# Altium schematic sheet Digital_Psu.SchDoc: Digital PSU
size A4; DrawnBy: Michael Watzek; Organization: HTL Hollabrunn; Address1: Abteilung Elektronik; Address2: Anton Ehrenfried-Straße 10; Address3: 2020 Hollabrunn; DocumentNumber: 07; Revision: 02; SheetNumber: 07; SheetTotal: 12; SPICEModelCacheAWIPVUZH: <root> / <DocumentId>AWIPVUZH</DocumentId> / <CacheFrame Number="0"> / <Model Name="cap" Kind="MDL"> / <Text>*Default semiconductor capacitor / .MODEL CAP C()</Text> / </Model> / </CacheFrame> / </root>
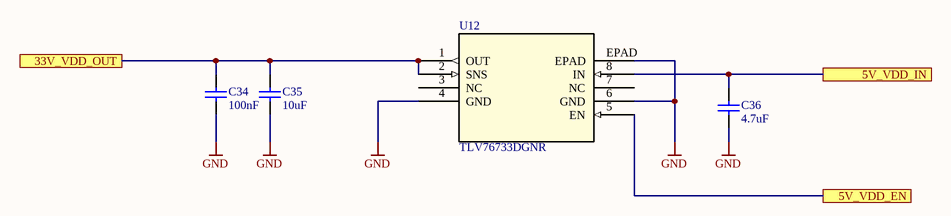
[diagram p0: Digital_Psu.SchDoc]

## Parts
C34  100nF  [C1206-KUE]
C35  10uF  [C1206-KUE]
C36  4.7uF  [C1206-KUE]
U12  TLV76733DGNR  [VSSOP8_DGN_TEX]

## Ports
5V_VDD_EN, 5V_VDD_IN, 33V_VDD_OUT

## Nets
GND: C34.1 C35.1 C36.1 U12.4(GND) U12.6(GND) U12.EPAD
5V_VDD_EN: U12.5(EN) ; port 5V_VDD_EN
5V_VDD_IN: C36.2 U12.8(IN) ; port 5V_VDD_IN
33V_VDD_OUT: C34.2 C35.2 U12.1(OUT) U12.2(SNS) ; port 33V_VDD_OUT

Not connected (* = marked no-connect by the designer): U12 3(NC) 7(NC)

## Notes on the sheet
- Title
- Size:
- Date:
- A4
- Number:
- Time:
- Revision:
- Sheet
- of
- HTL Hollabrunn
- Abteilung Elektronik
- Anton Ehrenfried-Straße 10
- 2020 Hollabrunn
- File:
- Drawn By:

## Library data of the parts
C34-C36 = Capacitor: Manufacturer: Kemet; Bezeichnung: Kerko +-10% 63V; Published: 8-Jun-2000; LatestRevisionDate: 17-Jul-2002; LatestRevisionNote: Re-released for DXP Platform.; PackageReference: RAD-0.3; Publisher: Altium Limited; PackageDescription: Radial Cap, Thru-Hole; 2 Leads; 0.3 in Pin Spacing; Orderingcode: *
  C34: Value: 100nF
  C35: Value: 10uF
  C36: Value: 4.7uF
U12 = TLV76733DGNR: Adjustable- and fixed-output, 1-A, 16-V, positive-voltage low-dropout (LDO) linear regulator 8-HVSSOP -40 to 125; Manufacturer_Name: Texas Instruments; Type: Power Management; Copyright: Copyright (C) 2025 Ultra Librarian. All rights reserved.; Manufacturer_Part_Number: TLV76733DGNR; RefDes: RefDes